# Altium schematic sheet W5500.SchDoc
size A4
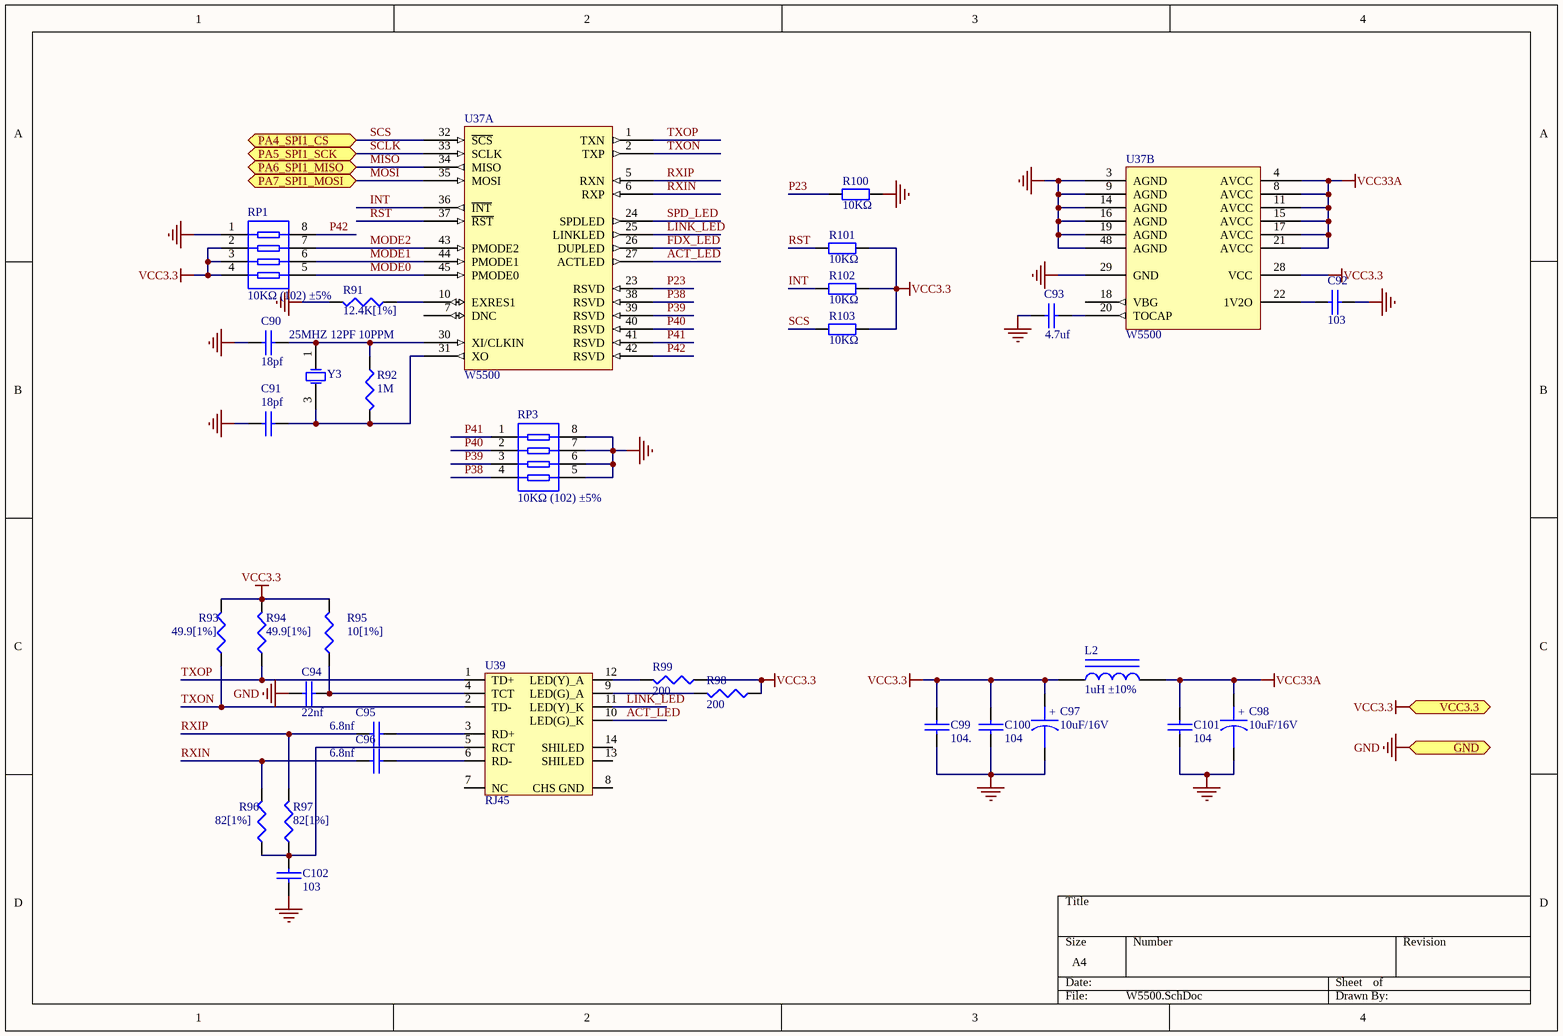
[diagram p0: W5500.SchDoc]

## Parts
C90  18pf  [0603_C]
C91  18pf  [0603_C]
C92  103  [0603_C]
C93  4.7uf  [0603_C]
C94  22nf  [0603_C]
C95  6.8nf  [0603_C]
C96  6.8nf  [0603_C]
C97  10uF/16V  [3216]
C98  10uF/16V  [3216]
C99  104.  [0603_C]
C100  104  [0603_C]
C101  104  [0603_C]
C102  103  [0603_C]
L2  1uH ±10%  [0805_L]
R91  12.4K[1%]  [0603_R]
R92  1M  [0603_R]
R93  49.9[1%]  [0603_R]
R94  49.9[1%]  [0603_R]
R95  10[1%]  [0603_R]
R96  82[1%]  [0603_R]
R97  82[1%]  [0603_R]
R98  200  [0603_R]
R99  200  [0603_R]
R100  10KΩ  [0603_R]
R101  10KΩ  [0603_R]
R102  10KΩ  [0603_R]
R103  10KΩ  [0603_R]
RP1  10KΩ (102) ±5%  [0603_Rx4]
RP3  10KΩ (102) ±5%  [0603_Rx4]
U37  W5500  [LQFP-48_7x7x05P]  (parts A,B of 2)
U39  RJ45  [HR911105A]
Y3  25MHZ 12PF 10PPM  [SMD-3225_4P]

## Ports
GND, PA4_SPI1_CS, PA5_SPI1_SCK, PA6_SPI1_MISO, PA7_SPI1_MOSI, VCC3.3

## Nets
GND: C90.2 C91.2 C92.1 C93.2 C94.1 C97.2 C98.2 C99.2 C100.2 C101.2 C102.2 R91.2 R100.2 RP1.1 RP3.5 RP3.6 RP3.7 RP3.8 U37.3(AGND) U37.9(AGND) U37.14(AGND) U37.16(AGND) U37.19(AGND) U37.29(GND) U37.48(AGND) ; port GND
VCC3.3: C97.1 C99.1 C100.1 L2.1 R93.2 R94.2 R95.2 R98.1 R99.1 R101.2 R102.2 R103.2 RP1.2 RP1.3 RP1.4 U37.28(VCC) ; port VCC3.3
VCC33A: C98.1 C101.1 L2.2 U37.4(AVCC) U37.8(AVCC) U37.11(AVCC) U37.15(AVCC) U37.17(AVCC) U37.21(AVCC)
ACT_LED: U37.27(ACTLED) U39.10(LED(G)_K)
FDX_LED: U37.26(DUPLED)
INT: R102.1 U37.36(~{INT})
LINK_LED: U37.25(LINKLED) U39.11(LED(Y)_K)
MISO: U37.34(MISO) ; port PA6_SPI1_MISO
MODE0: RP1.5 U37.45(PMODE0)
MODE1: RP1.6 U37.44(PMODE1)
MODE2: RP1.7 U37.43(PMODE2)
MOSI: U37.35(MOSI) ; port PA7_SPI1_MOSI
P23: R100.1 U37.23(RSVD)
P38: RP3.4 U37.38(RSVD)
P39: RP3.3 U37.39(RSVD)
P40: RP3.2 U37.40(RSVD)
P41: RP3.1 U37.41(RSVD)
P42: RP1.8 U37.42(RSVD)
RST: R101.1 U37.37(~{RST})
RXIN: C96.1 R96.2 U37.6(RXP)
RXIP: C95.1 R97.2 U37.5(RXN)
SCLK: U37.33(SCLK) ; port PA5_SPI1_SCK
SCS: R103.1 U37.32(~{SCS}) ; port PA4_SPI1_CS
SPD_LED: U37.24(SPDLED)
TXON: R93.1 U37.2(TXP) U39.2(TD-)
TXOP: R94.1 U37.1(TXN) U39.1(TD+)
NetC90_1: C90.1 R92.1 U37.30(XI/CLKIN) Y3.1(OSC1)
NetC91_1: C91.1 R92.2 U37.31(XO) Y3.3(OSC2)
NetC92_2: C92.2 U37.22(1V2O)
NetC93_1: C93.1 U37.20(TOCAP)
NetC94_2: C94.2 R95.1 U39.4(TCT)
NetC95_2: C95.2 U39.3(RD+)
NetC96_2: C96.2 U39.6(RD-)
NetC102_1: C102.1 R96.1 R97.1 U39.5(RCT)
NetR91_1: R91.1 U37.10(EXRES1)
NetR98_2: R98.2 U39.9(LED(G)_A)
NetR99_2: R99.2 U39.12(LED(Y)_A)

Not connected (* = marked no-connect by the designer): U37 7(DNC) 18(VBG); U39 7(NC) 8(CHS_GND) 13(SHILED) 14(SHILED)

## Notes on the sheet
- (in symbol CAPACITOR POL) +

## Library data of the parts
C90-C96 C99-C102 = CAP: Capacitor
C97 C98 = CAPACITOR POL: Capacitor
L2 = 0805 1uH 10%: 贴片电感; ComponentLink1Description: 供应商链接; ComponentLink1URL: http://www.szlcsc.com/product/details_1394.html; Package: 0805; Supplier: LC; SuppliersPartNumber: C1042
R91-R99 = RES1
R100-R103 = 0603 1.1KΩ (1101) 1%: 贴片电阻; ComponentLink1Description: 供应商链接; ComponentLink1URL: http://www.szlcsc.com/product/details_23491.html; Package: 0603; Supplier: LC; SuppliersPartNumber: C22764
RP1 RP3 = 0603*4  1KΩ (102) 5%: 贴片排阻; ComponentLink1Description: 供应商链接; ComponentLink1URL: http://www.szlcsc.com/product/details_20907.html; Package: 0603*4; Supplier: LC; SuppliersPartNumber: C20197
U39 = HR911105
Y3 = SMD-3225_4P  25MHZ 12PF 10PPM: 贴片晶振; ComponentLink1Description: 供应商链接; ComponentLink1URL: http://www.szlcsc.com/product/details_9526.html; Package: SMD-3225_4P; Supplier: LC; SuppliersPartNumber: C9006